# Altium schematic sheet daq_testv1.SchDoc
size A
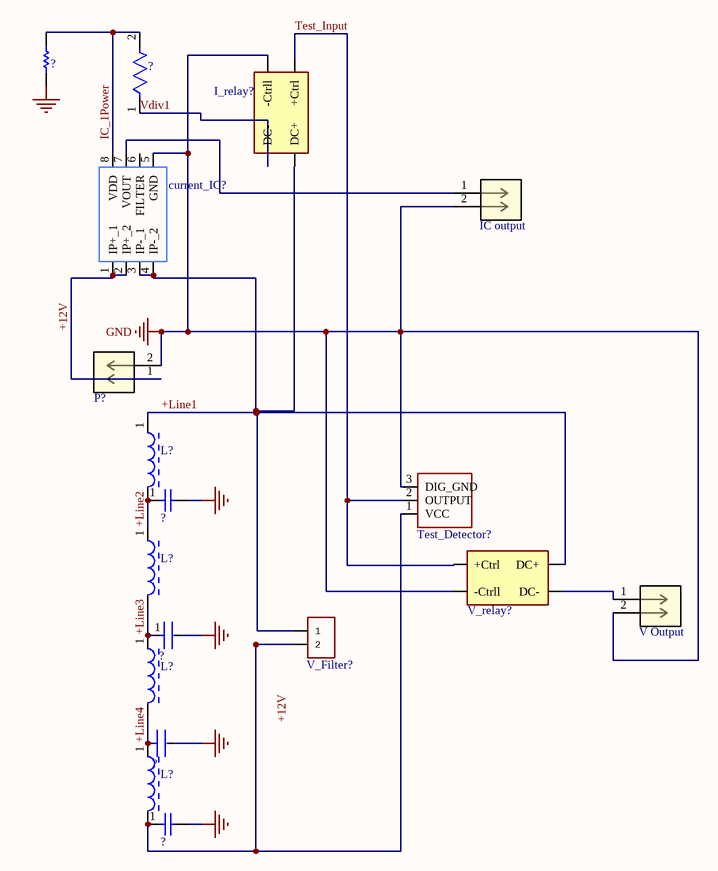
[diagram p0: daq_testv1.SchDoc]

## Parts
(Parts that share a designator on the sheet are numbered #1, #2 ... from top to bottom, then left to right.)
?#1  20OhmR  [20Ohm]  (value not drawn)
?#2  CRCW080530R0FKEA  [large30R]  (value not drawn)
?#3  GRM1555C1H221JA01  [220pF]  (value not drawn)
?#4  GRM3195C1H223JA01  [22nF]  (value not drawn)
?#5  C0805C223K5RACTU  [22nF]  (value not drawn)
?#6  C0805C226M9PACTU  [22uF]  (value not drawn)
current_IC?  ACHS-7121-000E  [ACHS IC]  (value not drawn)
I_relay?  Solid state relay  [CPC1002N]  (value not drawn)
IC_output  1054311102  [CONN_1054311102_MOL]  (value not drawn)
L?#1  SRN3015-1R0Y  [1uH]  (value not drawn)
L?#2  SRN3015-1R0Y  [1uH]  (value not drawn)
L?#3  SRN3015-1R0Y  [1uH]  (value not drawn)
L?#4  SRN3015-1R0Y  [1uH]  (value not drawn)
P?  1054311102  [CONN_1054311102_MOL]  (value not drawn)
Test_Detector?  IF-D95T  [IF-D95]  (value not drawn)
V_Filter?  PRPC001DFAN-RC  [PRPC001DFAN-RC]  (value not drawn)
V_Output  1054311102  [CONN_1054311102_MOL]  (value not drawn)
V_relay?  Solid state relay  [CPC1002N]  (value not drawn)

## Nets
GND: ?#1.1 ?#3.2 ?#4.2 ?#5.2 ?#6.2 current_IC?.5(GND) I_relay?.2(-Ctrll) IC_output.2 P?.2 Test_Detector?.3(DIG_GND) V_Output.2 V_relay?.2(-Ctrll)
+12V: current_IC?.1(IP+_1) current_IC?.2(IP+_2) P?.1
+Line1: current_IC?.3(IP-_1) current_IC?.4(IP-_2) I_relay?.4(DC+) L?#1.1 V_Filter?.1 V_relay?.4(DC+)
+Line2: ?#3.1 L?#1.2 L?#2.1
+Line3: ?#4.1 L?#2.2 L?#3.1
+Line4: ?#5.1 L?#3.2 L?#4.1
IC_1Power: ?#1.2 ?#2.2 current_IC?.8(VDD)
Test_Input: I_relay?.1(+Ctrl) Test_Detector?.2(OUTPUT) V_relay?.1(+Ctrl)
Vdiv1: ?#2.1 I_relay?.3(DC-)
Net?#6_1: ?#6.1 L?#4.2 Test_Detector?.1(VCC) V_Filter?.2
Netcurrent_IC?_7: current_IC?.7(VOUT) IC_output.1
NetV_Output_1: V_Output.1 V_relay?.3(DC-)

Not connected (* = marked no-connect by the designer): current_IC? 6(FILTER)

## Notes on the sheet
- Labels drawn without touching a wire or pin: +12V

## Library data of the parts
?#1 = 20OhmR: CRCW060320R0FKEA Checked Res Thick Film 0603 20 Ohm 1% 1/10W 100ppm/C Molded SMD SMD Paper T/R Chip SMD Resistors 0.1
?#2 = CRCW080530R0FKEA: Res Thick Film 0805 30 Ohm 1% 1/8W 100ppm/C Molded SMD SMD Paper T/R; Manufacturer: Vishay; Resistance: 30R; Power Rating: 125mW; Voltage Rating: 150V; Temperature Coefficient: 100ppm/°C; Supplier 1: Digi-Key; Supplier Part Number 1: 541-30.0CDKR-ND; Manufacturer Part Number: CRCW080530R0FKEA; RoHS: Yes; Category: Chip SMD Resistors; Pricing 1: 1=0.10000, 10=0.06700, 100=0.02710, 1000=0.01219, 2500=0.01058 (USD); Case/Package: 0805; Number of Pins: 2; Case Code (Metric): 2012; Case Code (Imperial): 0805; Contact Plating: Tin; Size Code: 0805; Weight: 0.000194oz; Min Operating Temperature: -55°C; Max Operating Temperature: 155°C; Tolerance: 1%; Packaging: Tape and Reel; Resistor Type: Thick Film; Voltage Rating (DC): 150V; Series: CRCW; Package Quantity: 10; Number of Terminations: 2; Max Power Dissipation: 125mW; Termination: SMD/SMT; Resistance Tolerance: 1%; Construction: Rectangular; Features: Automotive AEC-Q200; Technology: THICK FILM; Length: 2mm; Width: 0.049inch; Height: 0.45mm; Depth: 1.25mm; Radiation Hardening: No; RoHS Compliant: Yes; Lead Free: Lead Free; REACH SVHC: Unknown; Military Standard: Not; ComponentLink1URL: https://datasheet.ciiva.com/11810/0900766b80d98b26-11810429.pdf?src-supplier=RSComponents; ComponentLink1Description: https://datasheet.ciiva.com/11810/0900766b80d98b26-11810429.pdf?src-supplier=RSComponents; ComponentLink2URL: https://datasheet.ciiva.com/9019/dcrcwe3-9019231.pdf?src-supplier=Avnet; ComponentLink2Description: https://datasheet.ciiva.com/9019/dcrcwe3-9019231.pdf?src-supplier=Avnet; ComponentLink3URL: https://datasheet.ciiva.com/2467/dcrcwe3-2467377.pdf?src-supplier=Digi-Key; ComponentLink3Description: https://datasheet.ciiva.com/2467/dcrcwe3-2467377.pdf?src-supplier=Digi-Key; ComponentLink4URL: https://datasheet.ciiva.com/2467/dcrcwe3-2467378.pdf?src-supplier=Digi-Key; ComponentLink4Description: https://datasheet.ciiva.com/2467/dcrcwe3-2467378.pdf?src-supplier=Digi-Key; ComponentLink5URL: https://datasheet.ciiva.com/2467/dcrcwe3-2467379.pdf?src-supplier=Digi-Key; ComponentLink5Description: https://datasheet.ciiva.com/2467/dcrcwe3-2467379.pdf?src-supplier=Digi-Key; ComponentLink6URL: https://datasheet.ciiva.com/5550/dcrcwe3-109170-5550810.pdf?src-supplier=Mouser; ComponentLink6Description: https://datasheet.ciiva.com/5550/dcrcwe3-109170-5550810.pdf?src-supplier=Mouser; ComponentLink7URL: https://datasheet.ciiva.com/22682/1847332-22682669.pdf?src-supplier=Element14; ComponentLink7Description: https://datasheet.ciiva.com/22682/1847332-22682669.pdf?src-supplier=Element14; ComponentLink8URL: https://datasheet.ciiva.com/26316/fld-crcw-e3-data-en-26316525.pdf?src-supplier=Distrelec; ComponentLink8Description: https://datasheet.ciiva.com/26316/fld-crcw-e3-data-en-26316525.pdf?src-supplier=Distrelec; ComponentLink9URL: https://datasheet.ciiva.com/7732/1697337-7732101.pdf?src-supplier=Element14; ComponentLink9Description: https://datasheet.ciiva.com/7732/1697337-7732101.pdf?src-supplier=Element14; ComponentLink10URL: https://datasheet.ciiva.com/7732/1697337-7732102.pdf?src-supplier=Element14; ComponentLink10Description: https://datasheet.ciiva.com/7732/1697337-7732102.pdf?src-supplier=Element14; ComponentLink11URL: https://datasheet.ciiva.com/16852/dcrcwe3-16852253.pdf?src-supplier=Avnet+Europe; ComponentLink11Description: https://datasheet.ciiva.com/16852/dcrcwe3-16852253.pdf?src-supplier=Avnet+Europe
?#3 = GRM1555C1H221JA01: MURATA - 220 pF; Manufacturer: KEMET; Manufacturer Part Number: C0402C221K5RACTU; Dielectric Material: Ceramic; Voltage Rating: 50V; Tolerance: 10%; Dielectric: X7R; Dissipation Factor: 2.5%; RoHS: Yes; Category: Ceramic Capacitors; Stock 1: 199654; Pricing 1: 1=0.10000, 10=0.03600, 50=0.01980, 100=0.01620, 500=0.01156, 1000=0.00908, 2500=0.00825, 5000=0.00759 (USD); Mount: Surface Mount,PCB; Case/Package: 0402; Number of Pins: 2; Case Code (Imperial): 0402; Case Code (Metric): 1005; Contact Plating: Tin,Matte; Weight: 2.3E-05oz; Min Operating Temperature: -55°C; Max Operating Temperature: 125°C; Capacitance: 220pF; Packaging: Tape and Reel; Voltage Rating (DC): 50V; Package Quantity: 1; Termination: SMD/SMT; Voltage: 50V; Series: C; Construction: Flat; Length: 1mm; Width: 0.5mm; Height: 0.5mm; Thickness: 0.022inch; Depth: 0.5mm; Lead Pitch: 0.3mm; Radiation Hardening: No; RoHS Compliant: Yes; REACH SVHC: No SVHC; ComponentLink1URL: https://datasheet.ciiva.com/7747/1807957-7747493.pdf?src-supplier=Element14; ComponentLink1Description: https://datasheet.ciiva.com/7747/1807957-7747493.pdf?src-supplier=Element14; ComponentLink2URL: https://datasheet.ciiva.com/5969/kem-c1002-x7r-smd-5969768.pdf?src-supplier=Farnell; ComponentLink2Description: https://datasheet.ciiva.com/5969/kem-c1002-x7r-smd-5969768.pdf?src-supplier=Farnell; ComponentLink3URL: https://datasheet.ciiva.com/14609/70095383-14609163.pdf?src-supplier=Allied+Electronics; ComponentLink3Description: https://datasheet.ciiva.com/14609/70095383-14609163.pdf?src-supplier=Allied+Electronics; ComponentLink4URL: https://datasheet.ciiva.com/28645/1851736-28645422.pdf?src-supplier=Element14; ComponentLink4Description: https://datasheet.ciiva.com/28645/1851736-28645422.pdf?src-supplier=Element14; Supplier 1: Avnet; Supplier Part Number 1: GRM1555C1H221JA01D
?#4 = GRM3195C1H223JA01: MURATA - GRM3195C1H223JA01 - CAP; Manufacturer: KEMET; Manufacturer Part Number: C0805C223K5RACTU; Dielectric Material: Ceramic; Tolerance: 10%; Dielectric: X7R; Voltage Rating: 50V; RoHS: Yes; Category: Ceramic Capacitors; Stock 1: 179680; Pricing 1: 1=0.10000, 10=0.05200, 50=0.02840, 100=0.02320, 500=0.01656, 1000=0.01301 (USD); Mount: Surface Mount,PCB; Case/Package: 0805; Case Code (Imperial): 0805; Case Code (Metric): 2012; Weight: 0.000194oz; Min Operating Temperature: -55°C; Max Operating Temperature: 125°C; Packaging: Tape and Reel; Capacitance: 22nF; Voltage Rating (DC): 50V; Voltage: 50V; Series: C0805C; Termination: SMD/SMT; Construction: Flat; Length: 2mm; Width: 1.2mm; Height: 0.78mm; Depth: 1.25mm; Radiation Hardening: No; RoHS Compliant: Yes; REACH SVHC: No SVHC; ComponentLink1URL: https://datasheet.ciiva.com/18193/getdatasheetpartid-385695-18193669.pdf?src-supplier=Verical; ComponentLink1Description: https://datasheet.ciiva.com/18193/getdatasheetpartid-385695-18193669.pdf?src-supplier=Verical; Supplier 1: Digi-Key; Supplier Part Number 1: 490-1761-1-ND
?#5 = C0805C223K5RACTU: KEMET - C0805C223K5RACTU - CAP, MLCC, X7R, 22NF, 50V, 0805; Dielectric Material: Ceramic; Tolerance: 10%; Supplier 1: Digi-Key; Supplier Part Number 1: 399-1163-1-ND; Manufacturer: KEMET; Manufacturer Part Number: C0805C223K5RACTU; RoHS: Yes; Category: Ceramic Capacitors; Stock 1: 179680; Pricing 1: 1=0.10000, 10=0.05200, 50=0.02840, 100=0.02320, 500=0.01656, 1000=0.01301 (USD); Mount: Surface Mount,PCB; Case/Package: 0805; Case Code (Imperial): 0805; Case Code (Metric): 2012; Weight: 0.000194oz; Min Operating Temperature: -55°C; Max Operating Temperature: 125°C; Packaging: Tape and Reel; Capacitance: 22nF; Dielectric: X7R; Voltage Rating: 50V; Voltage Rating (DC): 50V; Voltage: 50V; Series: C0805C; Termination: SMD/SMT; Construction: Flat; Length: 2mm; Width: 1.2mm; Height: 0.78mm; Depth: 1.25mm; Radiation Hardening: No; RoHS Compliant: Yes; REACH SVHC: No SVHC; ComponentLink1URL: https://datasheet.ciiva.com/18193/getdatasheetpartid-385695-18193669.pdf?src-supplier=Verical; ComponentLink1Description: https://datasheet.ciiva.com/18193/getdatasheetpartid-385695-18193669.pdf?src-supplier=Verical
?#6 = C0805C226M9PACTU: KEMET         C0805C226M9PACTU            CERAMIC CAPACITOR, 22UF, 6.3V, X5R, 20%, 0805, FULL REEL; Dissipation Factor: 5%; Supplier 1: Digi-Key; Supplier Part Number 1: 399-4696-1-ND; Manufacturer: KEMET; Manufacturer Part Number: C0805C226M9PACTU; RoHS: Yes; Category: Ceramic Capacitors; Stock 1: 337605; Pricing 1: 1=0.21000, 10=0.14400, 50=0.08660, 100=0.07320, 500=0.05004, 1000=0.04428 (USD); Mount: Surface Mount,PCB; Case/Package: 0805; Number of Pins: 2; Case Code (Imperial): 0805; Case Code (Metric): 2012; Dielectric Material: Ceramic; Min Operating Temperature: -55°C; Max Operating Temperature: 85°C; Capacitance: 22uF; Tolerance: 20%; Package Quantity: 2500; Voltage Rating: 6.3V; Voltage Rating (DC): 6.3V; Packaging: Tape and Reel; Termination: SMD/SMT; Voltage: 6.3V; Construction: Flat; Dielectric: X5R; Length: 2mm; Width: 1.2mm; Height: 1.25mm; Depth: 1.25mm; Radiation Hardening: No; Lead Free: Lead Free; REACH SVHC: No SVHC; RoHS Compliant: Yes; ComponentLink1URL: https://datasheet.ciiva.com/7842/40889-7842585.pdf?src-supplier=Element14; ComponentLink1Description: https://datasheet.ciiva.com/7842/40889-7842585.pdf?src-supplier=Element14; ComponentLink2URL: https://datasheet.ciiva.com/18193/getdatasheetpartid-344134-18193702.pdf?src-supplier=Verical; ComponentLink2Description: https://datasheet.ciiva.com/18193/getdatasheetpartid-344134-18193702.pdf?src-supplier=Verical; ComponentLink3URL: https://datasheet.ciiva.com/22748/1918694-22748303.pdf?src-supplier=Element14; ComponentLink3Description: https://datasheet.ciiva.com/22748/1918694-22748303.pdf?src-supplier=Element14
current_IC? = ACHS-7121-000E: HALL EFFECT IC LF; Manufacturer: Broadcom; Polarity: Bidirectional; Current Sensing: 10A; Sensitivity: 185mV/A; Frequency: 80kHz; Linearity: 0.18%; Response Time: 4us; Max Supply Current: 15mA; Supplier 1: Digi-Key; Supplier Part Number 1: 516-4080-ND; Manufacturer Part Number: ACHS-7121-000E; RoHS: Yes; Category: Current Sensors; Stock 1: 5473; Pricing 1: 1=4.38000, 5=3.86000, 10=3.41100, 25=2.76720, 50=2.44520, 100=2.38100, 500=1.99484, 1000=1.86615, 5000=1.73745 (USD); Mount: Surface Mount; Case/Package: SOIC; Min Operating Temperature: -40°C; Max Operating Temperature: 110°C; Packaging: Rail/Tube; Sensing Method: Hall Effect; RoHS Compliant: Yes; ComponentLink1URL: https://docs.broadcom.com/docs/ACHS-712x-DS101?src-supplier=Digi-Key; ComponentLink1Description: https://docs.broadcom.com/docs/ACHS-712x-DS101?src-supplier=Digi-Key
I_relay? V_relay? = CPC1002N
IC_output P? V_Output = 1054311102: Nano-Fit Vertical Header, Surface Mount, 2.50mm Pitch, Single Row, 2 Circuits, 0.76 u00B5m Tin (Sn) Plating, Black,...; Manufacturer: Molex; Supplier 1: Digi-Key; Supplier Part Number 1: WM26073CT-ND; Manufacturer Part Number: 1054311102; RoHS: No; Category: Connectors; Stock 1: 1192; Pricing 1: 1=2.05000, 10=1.85700, 100=1.59160 (USD)
L?#1-L?#4 = SRN3015-1R0Y: INDUCTOR, POWER, 1UH, SEMI SHIELDED; Manufacturer: Bourns; Core Material: Ferrite; Material: Steel; Self Resonant Frequency: 145MHz; Tolerance: 30%; Current Rating: 2.35A; DC Resistance (DCR): 48mR; Test Frequency: 1MHz; Supplier 1: Digi-Key; Supplier Part Number 1: SRN3015-1R0YCT-ND; Manufacturer Part Number: SRN3015-1R0Y; RoHS: Yes; Category: Fixed Inductors; Stock 1: 8610; Pricing 1: 1=0.46000, 10=0.40400, 25=0.37520, 50=0.31760, 100=0.28880, 250=0.27144, 500=0.24256, 1000=0.19635 (USD); Case/Package: 1212; Number of Pins: 2; Weight: 0.001235oz; Contact Plating: Tin; Min Operating Temperature: -40°C; Max Operating Temperature: 125°C; Shielding: Shielded; Package Quantity: 2000; Inductance: 1uH; Packaging: Tape and Reel; Max DC Current: 2.35A; Termination: SMD/SMT; Inductance Tolerance: 30%; Saturation Current: 2.35A; RMS Current (Irms): 2.35A; Series: SRN3015; Resistor Type: Wirewound; DC Current: 2.35A; Frequency: 145MHz; Sample Rate (Hz): 1MHz; Length: 3mm; Width: 3mm; Height: 1.5mm; Depth: 3.1mm; Height - Seated (Max): 0.059inch; REACH SVHC: No SVHC; Military Standard: Not; RoHS Compliant: Yes; ComponentLink1URL: https://datasheet.ciiva.com/11802/0900766b80fe1f40-11802588.pdf?src-supplier=RSComponents; ComponentLink1Description: https://datasheet.ciiva.com/11802/0900766b80fe1f40-11802588.pdf?src-supplier=RSComponents; ComponentLink2URL: https://datasheet.ciiva.com/16940/70230774-16940935.pdf?src-supplier=Allied+Electronics; ComponentLink2Description: https://datasheet.ciiva.com/16940/70230774-16940935.pdf?src-supplier=Allied+Electronics; ComponentLink3URL: https://datasheet.ciiva.com/1048/srn3015-1048824.pdf?src-supplier=Digi-Key; ComponentLink3Description: https://datasheet.ciiva.com/1048/srn3015-1048824.pdf?src-supplier=Digi-Key; ComponentLink4URL: https://datasheet.ciiva.com/28678/1481208-28678232.pdf?src-supplier=Element14; ComponentLink4Description: https://datasheet.ciiva.com/28678/1481208-28678232.pdf?src-supplier=Element14; ComponentLink5URL: https://datasheet.ciiva.com/30197/587srn3015-30197944.pdf?src-supplier=Onlinecomponents.com; ComponentLink5Description: https://datasheet.ciiva.com/30197/587srn3015-30197944.pdf?src-supplier=Onlinecomponents.com; ComponentLink6URL: https://datasheet.ciiva.com/1048/srn3015-1048825.pdf?src-supplier=Digi-Key; ComponentLink6Description: https://datasheet.ciiva.com/1048/srn3015-1048825.pdf?src-supplier=Digi-Key; ComponentLink7URL: https://datasheet.ciiva.com/1048/srn3015-1048826.pdf?src-supplier=Digi-Key; ComponentLink7Description: https://datasheet.ciiva.com/1048/srn3015-1048826.pdf?src-supplier=Digi-Key; ComponentLink8URL: https://datasheet.ciiva.com/17284/srn3015-17284732.pdf?src-supplier=Avnet+Europe; ComponentLink8Description: https://datasheet.ciiva.com/17284/srn3015-17284732.pdf?src-supplier=Avnet+Europe; ComponentLink9URL: https://datasheet.ciiva.com/8517/srn3015-8517694.pdf?src-supplier=Avnet; ComponentLink9Description: https://datasheet.ciiva.com/8517/srn3015-8517694.pdf?src-supplier=Avnet; ComponentLink10URL: https://datasheet.ciiva.com/5986/srn3015-5986175.pdf?src-supplier=Farnell; ComponentLink10Description: https://datasheet.ciiva.com/5986/srn3015-5986175.pdf?src-supplier=Farnell; ComponentLink11URL: https://datasheet.ciiva.com/7847/srn3015-7847903.pdf?src-supplier=Element14; ComponentLink11Description: https://datasheet.ciiva.com/7847/srn3015-7847903.pdf?src-supplier=Element14
Test_Detector? = IF-D95T: DETECTOR PHOTOLOGIC TTL/CMOS; Manufacturer: Industrial Fiber Optics; Data Rate: 125Kbps; Operating Supply Current: 6mA; Rise Time: 70ns; Supplier 1: Digi-Key; Supplier Part Number 1: FB123-ND; Manufacturer Part Number: IF-D95T; RoHS: No; Category: Fiber Optic Cables; Package Quantity: 50; Lead Free: Contains Lead; ComponentLink1URL: https://datasheet.ciiva.com/2106/ifd95-2106550.pdf?src-supplier=Digi-Key; ComponentLink1Description: https://datasheet.ciiva.com/2106/ifd95-2106550.pdf?src-supplier=Digi-Key
V_Filter? = PRPC001DFAN-RC: Conn Header Vert 2POS; Manufacturer: Sullins; Number of Positions: 2; Connector Type: Male Pin; Row Spacing: 0.1inch; Supplier 1: Digi-Key; Supplier Part Number 1: S2211EC-01-ND; Manufacturer Part Number: PRPC001DFAN-RC; RoHS: Yes; Category: Connectors; Stock 1: 5964; Pricing 1: 1=0.09000, 10=0.08300, 25=0.06160, 50=0.05280, 100=0.05110, 250=0.04404, 500=0.04226 (USD); Mount: Through Hole; Color: Black; Contact Plating: Gold; Packaging: Bulk; Number of Rows: 2; Package Quantity: 1; Termination: Solder; Contact Mating Length: 0.318inch; ComponentLink1URL: https://datasheet.ciiva.com/741/xrxczzzdxxn-rc-11636-b-741404.pdf?src-supplier=Digi-Key; ComponentLink1Description: https://datasheet.ciiva.com/741/xrxczzzdxxn-rc-11636-b-741404.pdf?src-supplier=Digi-Key